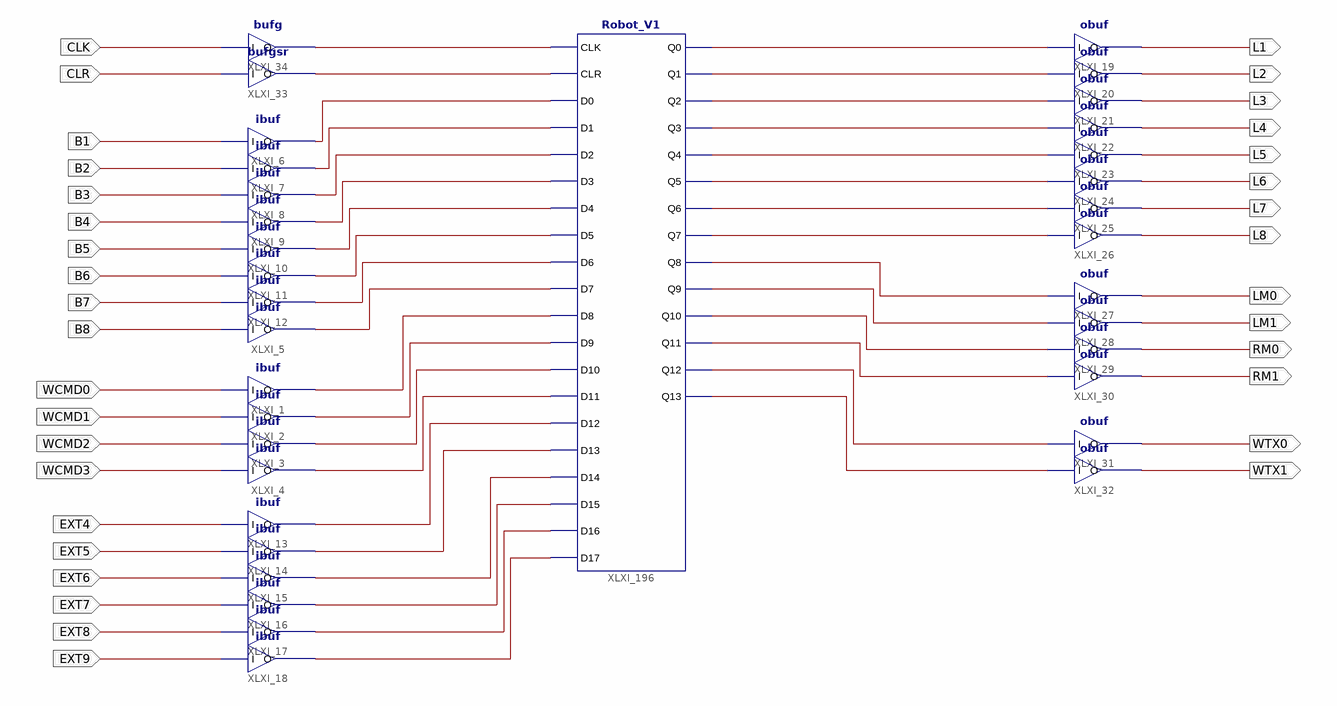
[diagram p0: schematic sheet 1]
// Xilinx ISE schematic Top_Level.sch (xc9500xl) as structural Verilog: 35 symbols, 34 ports
module Top_Level (
  input  CLK,
  input  CLR,
  input  B8,
  input  B1,
  input  B2,
  input  B3,
  input  B4,
  input  B5,
  input  B6,
  input  B7,
  input  WCMD0,
  input  WCMD1,
  input  WCMD2,
  input  WCMD3,
  input  EXT4,
  input  EXT5,
  input  EXT6,
  input  EXT7,
  input  EXT8,
  input  EXT9,
  output L1,
  output L2,
  output L3,
  output L4,
  output L5,
  output L6,
  output L7,
  output L8,
  output LM0,
  output RM0,
  output RM1,
  output WTX0,
  output WTX1,
  output LM1
);

  wire XLXN_128, XLXN_129, XLXN_130, XLXN_131, XLXN_132, XLXN_133, XLXN_134, XLXN_135, XLXN_136, XLXN_137,
       XLXN_158, XLXN_159, XLXN_160, XLXN_161, XLXN_164, XLXN_165, XLXN_166, XLXN_167, XLXN_168, XLXN_169,
       XLXN_239, XLXN_240, XLXN_241, XLXN_242, XLXN_243, XLXN_244, XLXN_245, XLXN_246, XLXN_253, XLXN_254,
       XLXN_255, XLXN_256, XLXN_257, XLXN_258;

  bufg XLXI_34 (.I(CLK), .O(XLXN_128));
  bufgsr XLXI_33 (.I(CLR), .O(XLXN_129));
  ibuf XLXI_6 (.I(B1), .O(XLXN_130));
  ibuf XLXI_7 (.I(B2), .O(XLXN_131));
  ibuf XLXI_8 (.I(B3), .O(XLXN_132));
  ibuf XLXI_9 (.I(B4), .O(XLXN_133));
  ibuf XLXI_10 (.I(B5), .O(XLXN_134));
  ibuf XLXI_11 (.I(B6), .O(XLXN_135));
  ibuf XLXI_12 (.I(B7), .O(XLXN_136));
  ibuf XLXI_5 (.I(B8), .O(XLXN_137));
  ibuf XLXI_3 (.I(WCMD2), .O(XLXN_160));
  ibuf XLXI_4 (.I(WCMD3), .O(XLXN_161));
  ibuf XLXI_2 (.I(WCMD1), .O(XLXN_159));
  ibuf XLXI_1 (.I(WCMD0), .O(XLXN_158));
  ibuf XLXI_13 (.I(EXT4), .O(XLXN_164));
  ibuf XLXI_14 (.I(EXT5), .O(XLXN_165));
  ibuf XLXI_15 (.I(EXT6), .O(XLXN_166));
  ibuf XLXI_16 (.I(EXT7), .O(XLXN_167));
  ibuf XLXI_17 (.I(EXT8), .O(XLXN_168));
  ibuf XLXI_18 (.I(EXT9), .O(XLXN_169));
  obuf XLXI_19 (.I(XLXN_239), .O(L1));
  obuf XLXI_20 (.I(XLXN_240), .O(L2));
  obuf XLXI_21 (.I(XLXN_241), .O(L3));
  obuf XLXI_22 (.I(XLXN_242), .O(L4));
  obuf XLXI_23 (.I(XLXN_243), .O(L5));
  obuf XLXI_24 (.I(XLXN_244), .O(L6));
  obuf XLXI_25 (.I(XLXN_245), .O(L7));
  obuf XLXI_26 (.I(XLXN_246), .O(L8));
  obuf XLXI_27 (.I(XLXN_253), .O(LM0));
  obuf XLXI_28 (.I(XLXN_254), .O(LM1));
  obuf XLXI_29 (.I(XLXN_255), .O(RM0));
  obuf XLXI_30 (.I(XLXN_256), .O(RM1));
  obuf XLXI_31 (.I(XLXN_257), .O(WTX0));
  obuf XLXI_32 (.I(XLXN_258), .O(WTX1));
  Robot_V1 XLXI_196 (
    .CLK(XLXN_128), .CLR(XLXN_129), .D0(XLXN_130), .D1(XLXN_131), .D10(XLXN_160), .D11(XLXN_161),
    .D12(XLXN_164), .D13(XLXN_165), .D14(XLXN_166), .D15(XLXN_167), .D16(XLXN_168), .D17(XLXN_169),
    .D2(XLXN_132), .D3(XLXN_133), .D4(XLXN_134), .D5(XLXN_135), .D6(XLXN_136), .D7(XLXN_137), .D8(XLXN_158),
    .D9(XLXN_159), .Q0(XLXN_239), .Q1(XLXN_240), .Q10(XLXN_255), .Q11(XLXN_256), .Q12(XLXN_257),
    .Q13(XLXN_258), .Q2(XLXN_241), .Q3(XLXN_242), .Q4(XLXN_243), .Q5(XLXN_244), .Q6(XLXN_245), .Q7(XLXN_246),
    .Q8(XLXN_253), .Q9(XLXN_254));
endmodule
